# Altium schematic sheet obc_32m1.SchDoc
size A4
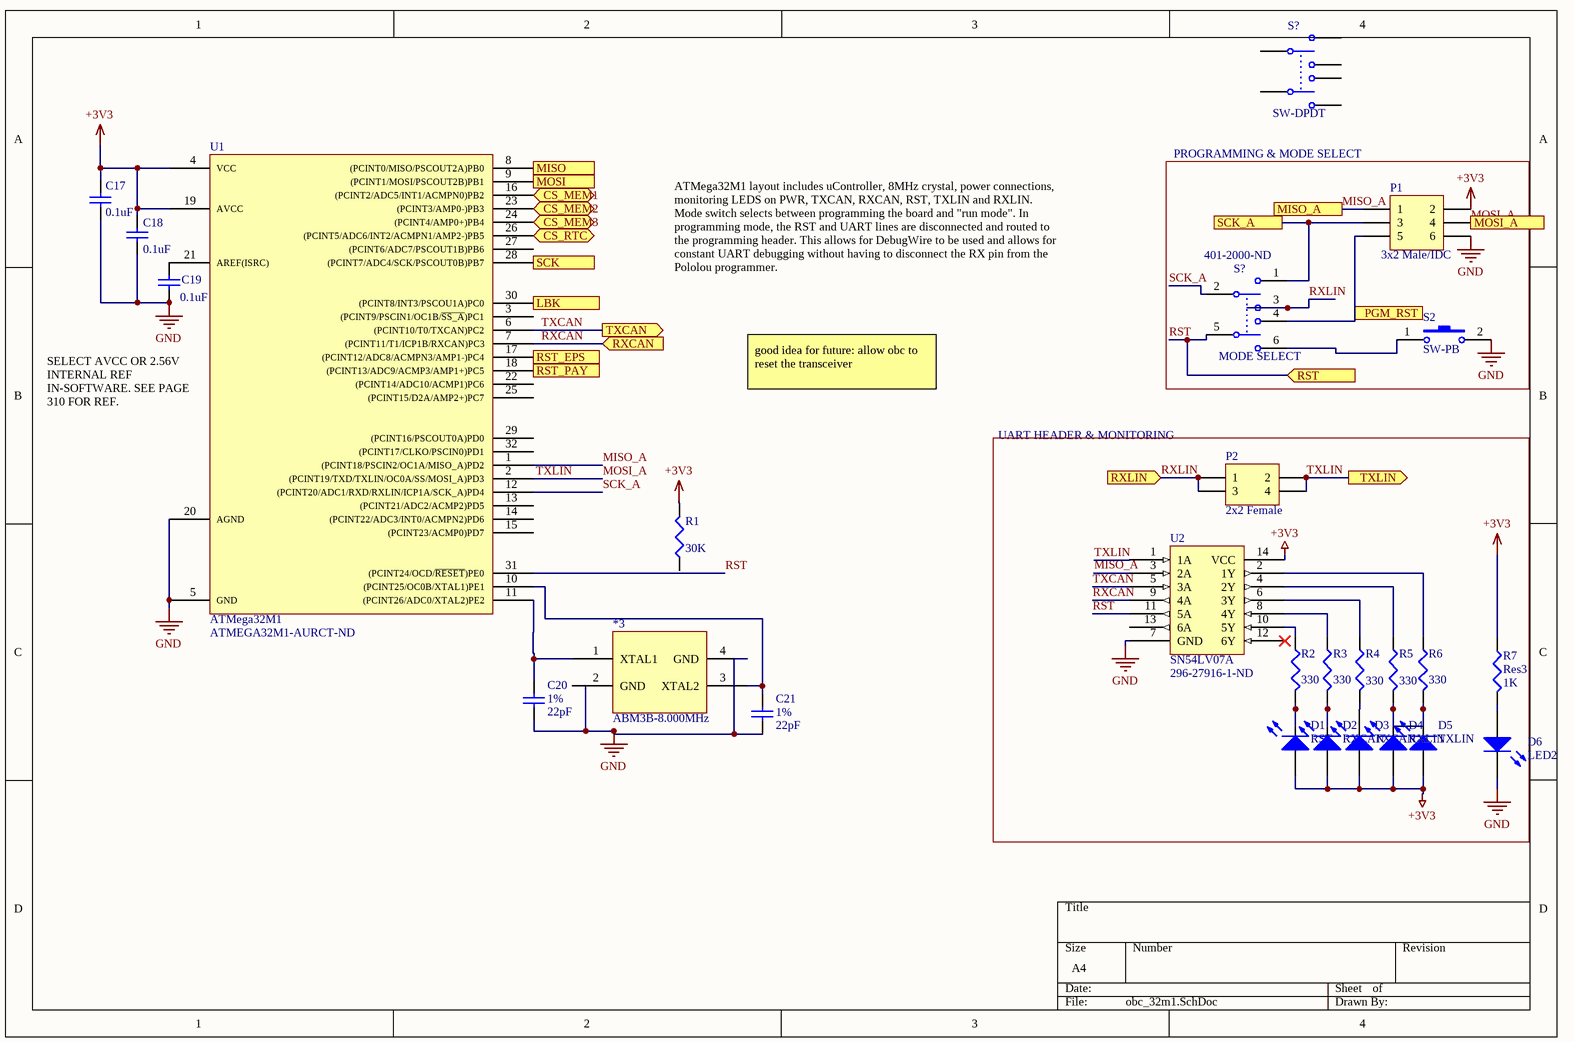
[diagram p0: obc_32m1.SchDoc]

## Parts
(Parts that share a designator on the sheet are numbered #1, #2 ... from top to bottom, then left to right.)
*3  ABM3B-8.000MHz  [OSCSC500X320X110-4N]
C17  value 0.1uF  [1608[0603]]  (hidden comment: Cap Semi)
C18  value 0.1uF  [1608[0603]]  (hidden comment: Cap Semi)
C19  value 0.1uF  [1608[0603]]  (hidden comment: Cap Semi)
C20  1%  value 22pF  [1608[0603]]
C21  1%  value 22pF  [1608[0603]]
D1  RST  [1608[0603]]
D2  RXCAN  [1608[0603]]
D3  TXCAN  [1608[0603]]
D4  RXLIN  [1608[0603]]
D5  TXLIN  [1608[0603]]
D6  LED2  [1608[0603]]
P1  3x2 Male/IDC  [HDR2X3]
P2  2x2 Female  [HDR2X2]
R1  value 30K  [J1-0603]
R2  value 330  [J1-0603]  (hidden comment: Res3)
R3  value 330  [J1-0603]  (hidden comment: Res3)
R4  value 330  [J1-0603]  (hidden comment: Res3)
R5  value 330  [J1-0603]  (hidden comment: Res3)
R6  value 330  [J1-0603]  (hidden comment: Res3)
R7  Res3  value 1K  [J1-0603]
S2  SW-PB  [SW415-ND]
S?#1  SW-DPDT  [DPST_32m1_switch]
S?#2  MODE SELECT  Supplier Part Number: 401-2000-ND  [DPST_32m1_switch]
U1  ATMega32M1  Supplier Part Number 1: ATMEGA32M1-AURCT-ND  [QFP80P900X900X120-32N]
U2  SN54LV07A  Supplier Part Number: 296-27916-1-ND  [SOP65P640X120-14N]

## Blocks framed on the sheet
PROGRAMMING & MODE SELECT: P1 S2 S?#2
UART HEADER & MONITORING: D1-D6 P2 R2-R7 U2

## Ports
CS_MEM1 (bidir), CS_MEM2 (bidir), CS_MEM3 (bidir), CS_RTC (bidir), LBK (out), MISO (in), MISO_A, MOSI (out), MOSI_A, PGM_RST, RST (in), RST_EPS, RST_PAY, RXCAN (in), RXLIN (in), SCK (out), SCK_A, TXCAN (out), TXLIN (out)

## Nets
+3V3: C17.2 C18.2 D1.1(A) D2.1(A) D3.1(A) D4.1(A) D5.1(A) P1.2 R1.2 R7.1 U1.4(VCC) U1.19(AVCC) U2.14(VCC)
GND: *3.4(GND) C17.1 C18.1 C19.2 C20.1 C21.1 D6.2(K) P1.6 S2.2 U1.5(GND) U1.20(AGND) U2.7(GND)
CS_MEM1: U1.16((PCINT2/ADC5/INT1/ACMPN0)PB2) ; port CS_MEM1
CS_MEM2: U1.23((PCINT3/AMP0-)PB3) ; port CS_MEM2
CS_MEM3: U1.24((PCINT4/AMP0+)PB4) ; port CS_MEM3
CS_RTC: U1.26((PCINT5/ADC6/INT2/ACMPN1/AMP2-)PB5) ; port CS_RTC
LBK: U1.30((PCINT8/INT3/PSCOU1A)PC0) ; port LBK
MISO: U1.8((PCINT0/MISO/PSCOUT2A)PB0) ; port MISO
MISO_A: P1.1 U1.1((PCINT18/PSCIN2/OC1A/MISO_A)PD2) U2.3(2A) ; port MISO_A
MOSI: U1.9((PCINT1/MOSI/PSCOUT2B)PB1) ; port MOSI
MOSI_A: P1.4 P2.2 P2.4 U1.2((PCINT19/TXD/TXLIN/OC0A/SS/MOSI_A)PD3) U2.1(1A) ; port TXLIN, port MOSI_A  [also labelled TXLIN]
PGM_RST: P1.5 S?#2.4 ; port PGM_RST
RST: S?#2.5 U1.31((PCINT24/OCD/~{RESET})PE0) U2.11(5A) ; port RST
RST_EPS: U1.17((PCINT12/ADC8/ACMPN3/AMP1-)PC4) ; port RST_EPS
RST_PAY: U1.18((PCINT13/ADC9/ACMP3/AMP1+)PC5) ; port RST_PAY
RXCAN: U1.7((PCINT11/T1/ICP1B/RXCAN)PC3) U2.9(4A) ; port RXCAN
RXLIN: P2.1 P2.3 S?#2.3 ; port RXLIN
SCK: U1.28((PCINT7/ADC4/SCK/PSCOUT0B)PB7) ; port SCK
SCK_A: S?#2.2 U1.12((PCINT20/ADC1/RXD/RXLIN/ICP1A/SCK_A)PD4)
SCK_A: P1.3 S?#2.1 ; port SCK_A  [a separate net that carries the same name]
TXCAN: U1.6((PCINT10/T0/TXCAN)PC2) U2.5(3A) ; port TXCAN
Net*3_1: *3.1(XTAL1) C20.2 U1.11((PCINT26/ADC0/XTAL2)PE2)
Net*3_3: *3.3(XTAL2) C21.2 U1.10((PCINT25/OC0B/XTAL1)PE1)
NetC19_1: C19.1 U1.21(AREF(ISRC))
NetD1_2: D1.2(K) R2.2
NetD2_2: D2.2(K) R3.2
NetD3_2: D3.2(K) R4.2
NetD4_2: D4.2(K) D5.2(K) R5.2 R6.2
NetD6_1: D6.1(A) R7.2
NetR2_1: R2.1 U2.10(5Y)
NetR3_1: R3.1 U2.8(4Y)
NetR4_1: R4.1 U2.6(3Y)
NetR5_1: R5.1 U2.4(2Y)
NetR6_1: R6.1 U2.2(1Y)
NetS2_1: S2.1 S?#2.6

Not connected (* = marked no-connect by the designer): *3 2(GND); R1 1; S?#1 1 2 3 4 5 6; U1 3((PCINT9/PSCIN1/OC1B/~{SS_A})PC1) 13((PCINT21/ADC2/ACMP2)PD5) 14((PCINT22/ADC3/INT0/ACMPN2)PD6) 15((PCINT23/ACMP0)PD7) 22((PCINT14/ADC10/ACMP1)PC6) 25((PCINT15/D2A/AMP2+)PC7) 27((PCINT6/ADC7/PSCOUT1B)PB6) 29((PCINT16/PSCOUT0A)PD0) 32((PCINT17/CLKO/PSCIN0)PD1); U2 12(6Y)* 13(6A)

## Notes on the sheet
- ATMega32M1 layout includes uController, 8MHz crystal, power connections, monitoring LEDS on PWR, TXCAN, RXCAN, RST, TXLIN and RXLIN. Mode switch selects between programming the board and "run mode". In programming mode, the RST and UART lines are disconnected and routed to the programming header. This allows for DebugWire to be used and allows for constant UART debugging without having to disconnect the RX pin from the Pololou programmer.
- good idea for future: allow obc to reset the transceiver
- (near U1) SELECT AVCC OR 2.56V INTERNAL REF IN-SOFTWARE. SEE PAGE 310 FOR REF.

## Library data of the parts
C17-C21 = Cap Semi: Capacitor (Semiconductor SIM Model); Published: 8-Jun-2000; LatestRevisionDate: 29-May-2009; LatestRevisionNote: IPC-7351 Footprint Added.; PackageReference: C1206; Publisher: Altium Limited; PackageDescription: Chip Capacitor
D1-D6 = LED2: Typical RED, GREEN, YELLOW, AMBER GaAs LED; Published: 8-Jun-2000; LatestRevisionDate: 17-Jul-2002; LatestRevisionNote: Re-released for DXP Platform.; PackageVersion: Feb-2002; PackageReference: 3.2X1.6X1.1; Publisher: Altium Limited; PackageDescription: SM LED; 2 Flat Leads
P1 = Header 3X2: 2x3 through-hole programming header, IDC; LatestRevisionDate: 17-Jul-2002; LatestRevisionNote: Re-released for DXP Platform.; Publisher: Altium Limited
P2 = Header 2X2: Header, 2-Pin, Dual row; LatestRevisionDate: 17-Jul-2002; LatestRevisionNote: Re-released for DXP Platform.; Publisher: Altium Limited
R1 = Res3: 30K Pull-up resistor for RST. See page; Published: 8-Jun-2000; LatestRevisionDate: 29-May-2009; LatestRevisionNote: IPC-7351 Footprint Added.; PackageReference: J1-0603; Publisher: Altium Limited; PackageDescription: Chip Resistor
R2-R7 = Res3: Resistor; Published: 8-Jun-2000; LatestRevisionDate: 29-May-2009; LatestRevisionNote: IPC-7351 Footprint Added.; PackageReference: J1-0603; Publisher: Altium Limited; PackageDescription: Chip Resistor
S2 = SW-PB: Switch; Published: 24-Mar-1999; LatestRevisionDate: 17-Jul-2002; LatestRevisionNote: Re-released for DXP Platform.; PackageReference: SPST-2; Publisher: Altium Limited; PackageDescription: Switch; 2 Leads
S?#1 S?#2 = SW-DPDT: Double-Pole, Double-Throw Switch; Published: 24-Mar-1999; LatestRevisionDate: 17-Jul-2002; LatestRevisionNote: Re-released for DXP Platform.; PackageReference: DPDT-6; Publisher: Altium Limited; PackageDescription: Switch; 6 Leads
  S?#2: Supplier: Digi-Key
U1 = ATMega32M1: Atmel 8-bit AVR microcontroller.; Supplier 1: Digi-Key
U2 = SN54LV07A: Six element 1-bit non-inverting open-drain buffer.; Supplier: Digi-Key